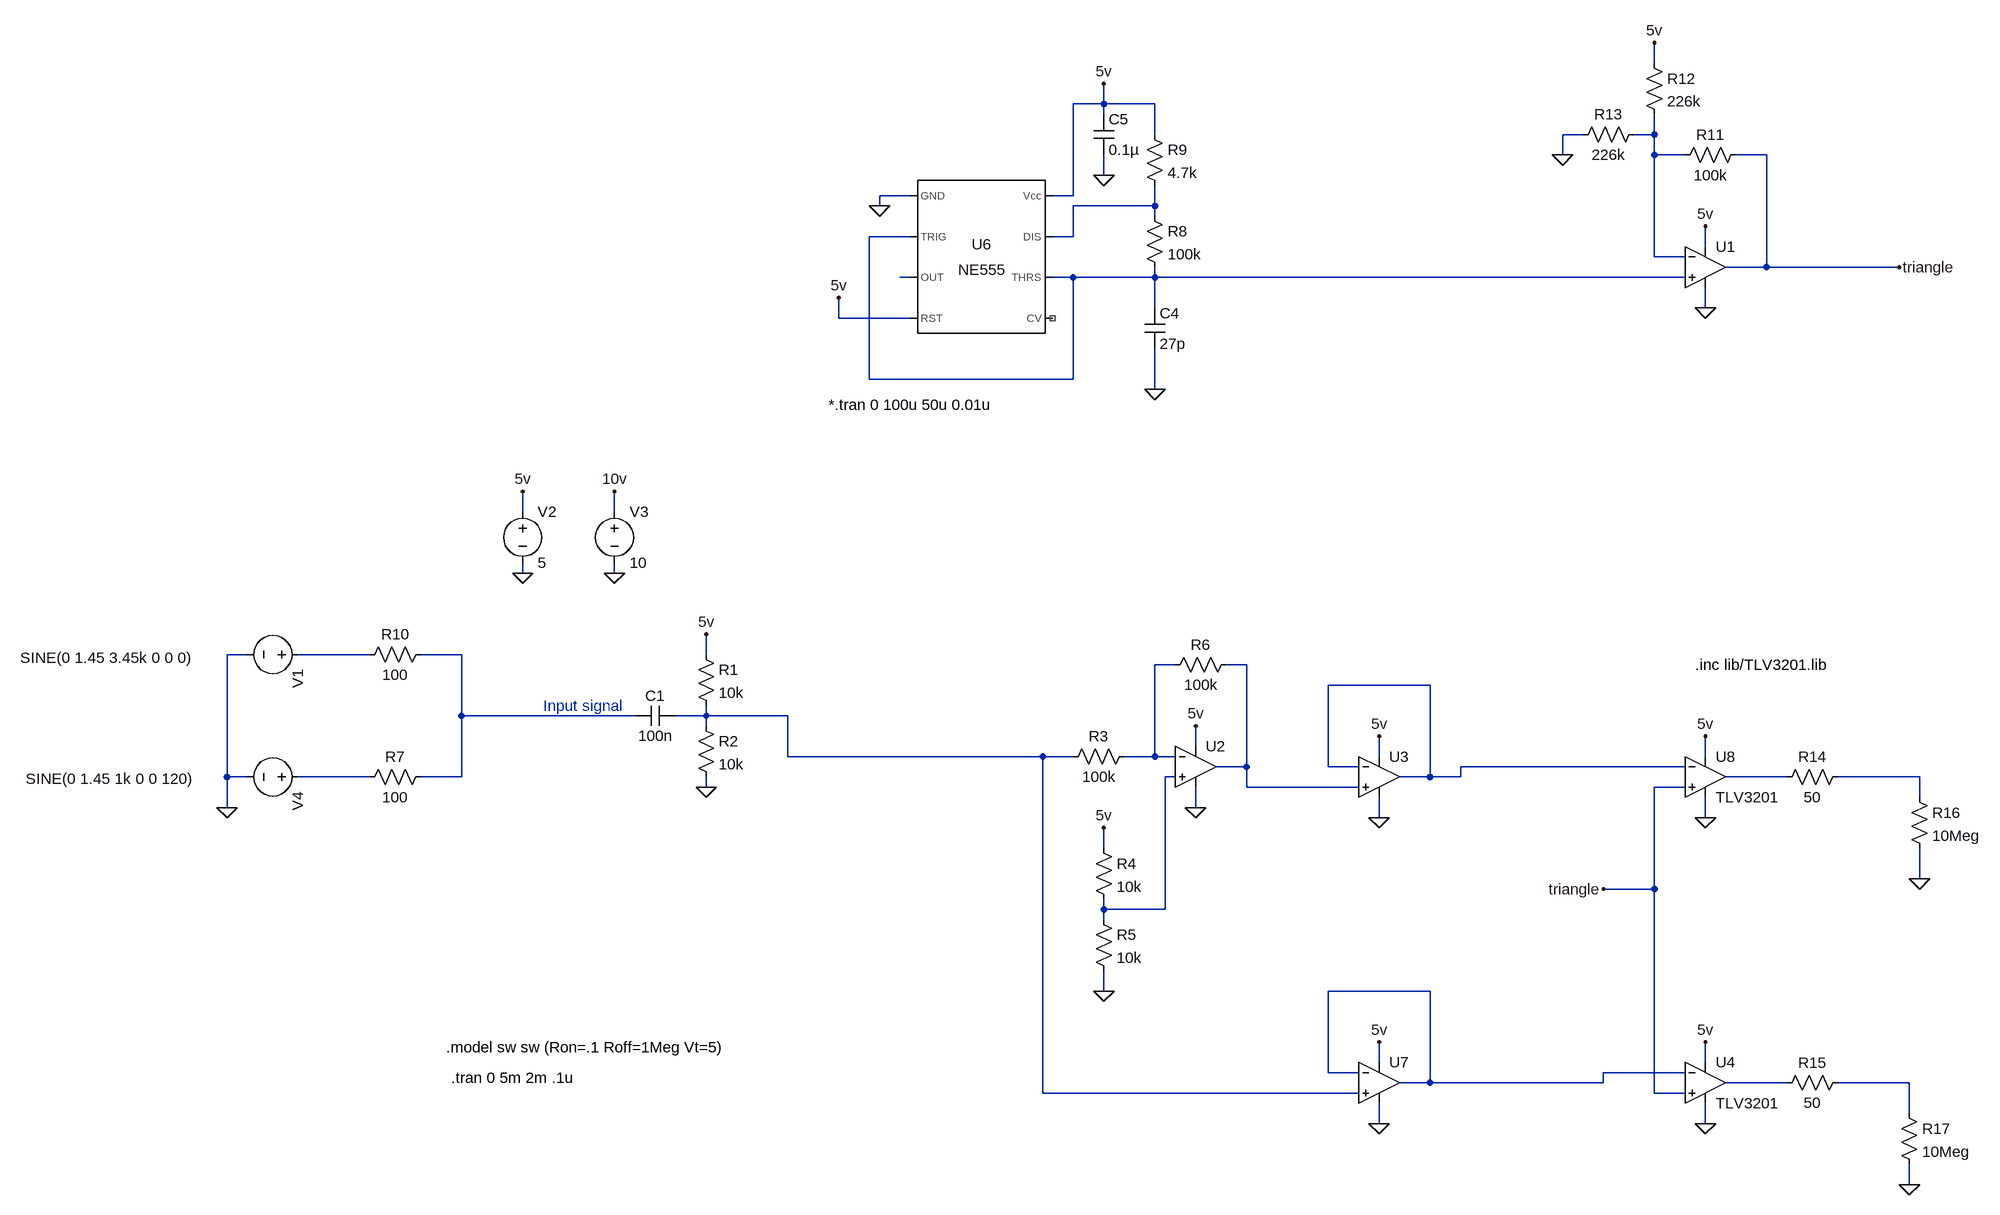
[diagram p0: schematic test.asc]
test.asc, the LTspice schematic file:
Version 4
SHEET 1 4872 804
WIRE 2064 -976 2064 -1008
WIRE 1200 -912 1200 -944
WIRE 1200 -912 1152 -912
WIRE 1280 -912 1200 -912
WIRE 1200 -896 1200 -912
WIRE 1280 -864 1280 -912
WIRE 1952 -864 1920 -864
WIRE 2064 -864 2064 -896
WIRE 2064 -864 2032 -864
WIRE 1920 -832 1920 -864
WIRE 2064 -832 2064 -864
WIRE 2112 -832 2064 -832
WIRE 2240 -832 2192 -832
WIRE 1200 -800 1200 -832
WIRE 896 -768 848 -768
WIRE 1152 -768 1152 -912
WIRE 1152 -768 1120 -768
WIRE 848 -752 848 -768
WIRE 1280 -752 1280 -784
WIRE 1280 -752 1152 -752
WIRE 1280 -736 1280 -752
WIRE 896 -704 832 -704
WIRE 1152 -704 1152 -752
WIRE 1152 -704 1120 -704
WIRE 2144 -688 2144 -720
WIRE 2064 -672 2064 -832
WIRE 2112 -672 2064 -672
WIRE 2240 -656 2240 -832
WIRE 2240 -656 2176 -656
WIRE 2448 -656 2240 -656
WIRE 896 -640 880 -640
WIRE 1152 -640 1120 -640
WIRE 1280 -640 1280 -656
WIRE 1280 -640 1152 -640
WIRE 2112 -640 1280 -640
WIRE 1280 -592 1280 -640
WIRE 2144 -592 2144 -624
WIRE 784 -576 784 -608
WIRE 896 -576 784 -576
WIRE 832 -480 832 -704
WIRE 1152 -480 1152 -640
WIRE 1152 -480 832 -480
WIRE 1280 -464 1280 -528
WIRE 288 -272 288 -304
WIRE 432 -272 432 -304
WIRE 288 -176 288 -192
WIRE 432 -176 432 -192
WIRE -144 -48 -176 -48
WIRE 48 -48 -64 -48
WIRE 192 -48 128 -48
WIRE 576 -48 576 -80
WIRE 1312 -32 1280 -32
WIRE 1424 -32 1392 -32
WIRE 1712 0 1552 0
WIRE 192 48 192 -48
WIRE 464 48 192 48
WIRE 576 48 576 32
WIRE 576 48 528 48
WIRE 704 48 576 48
WIRE 576 64 576 48
WIRE 1344 96 1344 64
WIRE 704 112 704 48
WIRE 1104 112 704 112
WIRE 1152 112 1104 112
WIRE 1280 112 1280 -32
WIRE 1280 112 1232 112
WIRE 1312 112 1280 112
WIRE 1632 112 1632 80
WIRE 2144 112 2144 80
WIRE 1424 128 1424 -32
WIRE 1424 128 1376 128
WIRE 1552 128 1552 0
WIRE 1600 128 1552 128
WIRE 2112 128 1760 128
WIRE -176 144 -176 -48
WIRE -144 144 -176 144
WIRE 48 144 -64 144
WIRE 192 144 192 48
WIRE 192 144 128 144
WIRE 1312 144 1296 144
WIRE 1712 144 1712 0
WIRE 1712 144 1664 144
WIRE 1760 144 1760 128
WIRE 1760 144 1712 144
WIRE 2272 144 2176 144
WIRE 2480 144 2352 144
WIRE 576 160 576 144
WIRE 1424 160 1424 128
WIRE 1600 160 1424 160
WIRE 2112 160 2064 160
WIRE 2480 176 2480 144
WIRE -176 192 -176 144
WIRE 1344 192 1344 160
WIRE 1632 208 1632 176
WIRE 2144 208 2144 176
WIRE 1200 256 1200 224
WIRE 2480 304 2480 256
WIRE 2064 320 2064 160
WIRE 2064 320 1984 320
WIRE 1200 352 1200 336
WIRE 1296 352 1296 144
WIRE 1296 352 1200 352
WIRE 1200 368 1200 352
WIRE 1200 480 1200 448
WIRE 1712 480 1552 480
WIRE 1632 592 1632 560
WIRE 2144 592 2144 560
WIRE 1552 608 1552 480
WIRE 1600 608 1552 608
WIRE 2112 608 1984 608
WIRE 1712 624 1712 480
WIRE 1712 624 1664 624
WIRE 1984 624 1984 608
WIRE 1984 624 1712 624
WIRE 2272 624 2176 624
WIRE 2464 624 2352 624
WIRE 1104 640 1104 112
WIRE 1600 640 1104 640
WIRE 2064 640 2064 320
WIRE 2112 640 2064 640
WIRE 2464 672 2464 624
WIRE 1632 688 1632 656
WIRE 2144 688 2144 656
WIRE 2464 784 2464 752
FLAG 576 160 0
FLAG 576 -80 5v
FLAG 288 -176 0
FLAG 288 -304 5v
FLAG 1344 64 5v
FLAG 1344 192 0
FLAG 1200 480 0
FLAG 1200 224 5v
FLAG 1200 -800 0
FLAG 1200 -944 5v
FLAG 784 -608 5v
FLAG 2448 -656 triangle
FLAG 432 -176 0
FLAG 432 -304 10v
FLAG 1632 208 0
FLAG 1632 688 0
FLAG 1632 80 5v
FLAG 1632 560 5v
FLAG 2144 208 0
FLAG 2144 688 0
FLAG 2144 80 5v
FLAG 2144 560 5v
FLAG 1984 320 triangle
FLAG 848 -752 0
FLAG 1280 -464 0
FLAG 2144 -592 0
FLAG 2144 -720 5v
FLAG 2064 -1008 5v
FLAG 1920 -832 0
FLAG -176 192 0
FLAG 2480 304 0
FLAG 2464 784 0
SYMBOL voltage -48 -48 R90
WINDOW 123 0 0 Left 0
WINDOW 39 0 0 Left 0
WINDOW 3 5 186 VRight 2
SYMATTR Value SINE(0 1.45 3.45k 0 0 0)
SYMATTR InstName V1
SYMBOL cap 528 32 R90
WINDOW 0 0 32 VBottom 2
WINDOW 3 32 32 VTop 2
SYMATTR InstName C1
SYMATTR Value 100n
SYMBOL res 560 -64 R0
SYMATTR InstName R1
SYMATTR Value 10k
SYMATTR SpiceLine tol=1
SYMBOL res 560 48 R0
SYMATTR InstName R2
SYMATTR Value 10k
SYMATTR SpiceLine tol=1
SYMBOL voltage 288 -288 R0
WINDOW 123 0 0 Left 0
WINDOW 39 0 0 Left 0
SYMATTR InstName V2
SYMATTR Value 5
SYMBOL res 1248 96 R90
WINDOW 0 0 56 VBottom 2
WINDOW 3 32 56 VTop 2
SYMATTR InstName R3
SYMATTR Value 100k
SYMATTR SpiceLine tol=1
SYMBOL res 1184 240 R0
SYMATTR InstName R4
SYMATTR Value 10k
SYMATTR SpiceLine tol=1
SYMBOL res 1184 352 R0
SYMATTR InstName R5
SYMATTR Value 10k
SYMATTR SpiceLine tol=1
SYMBOL res 1408 -48 R90
WINDOW 0 0 56 VBottom 2
WINDOW 3 32 56 VTop 2
SYMATTR InstName R6
SYMATTR Value 100k
SYMATTR SpiceLine tol=1
SYMBOL Misc\\NE555 1008 -672 R0
SYMATTR InstName U6
SYMBOL cap 1264 -592 R0
SYMATTR InstName C4
SYMATTR Value 27p
SYMATTR SpiceLine V=50 Irms=0 Rser=0 Lser=0 mfg="Murata" pn="GRM0335C1H270JA01" type="C0G"
SYMBOL res 1264 -752 R0
SYMATTR InstName R8
SYMATTR Value 100k
SYMATTR SpiceLine tol=0.1 pwr=100m
SYMBOL res 1264 -880 R0
SYMATTR InstName R9
SYMATTR Value 4.7k
SYMATTR SpiceLine tol=0.1 pwr=100m
SYMBOL cap 1184 -896 R0
SYMATTR InstName C5
SYMATTR Value 0.1µ
SYMBOL voltage 432 -288 R0
WINDOW 123 0 0 Left 0
WINDOW 39 0 0 Left 0
SYMATTR InstName V3
SYMATTR Value 10
SYMBOL res 2208 -848 R90
WINDOW 0 0 56 VBottom 2
WINDOW 3 32 56 VTop 2
SYMATTR InstName R11
SYMATTR Value 100k
SYMATTR SpiceLine tol=1
SYMBOL res 2048 -992 R0
SYMATTR InstName R12
SYMATTR Value 226k
SYMATTR SpiceLine tol=1
SYMBOL res 2048 -880 R90
WINDOW 0 0 56 VBottom 2
WINDOW 3 32 56 VTop 2
SYMATTR InstName R13
SYMATTR Value 226k
SYMATTR SpiceLine tol=1
SYMBOL OpAmps\\UniversalOpAmp2 2144 -656 R0
SYMATTR InstName U1
SYMATTR Value2 Avol=1Meg GBW=50Meg Slew=38Meg
SYMBOL OpAmps\\UniversalOpAmp2 1344 128 R0
SYMATTR InstName U2
SYMATTR Value2 Avol=1Meg GBW=50Meg Slew=38Meg
SYMBOL OpAmps\\UniversalOpAmp2 1632 144 R0
SYMATTR InstName U3
SYMATTR Value2 Avol=1Meg GBW=50Meg Slew=38Meg
SYMBOL OpAmps\\UniversalOpAmp2 1632 624 R0
SYMATTR InstName U7
SYMATTR Value2 Avol=1Meg GBW=50Meg Slew=38Meg
SYMBOL OpAmps\\opamp2 2144 80 R0
SYMATTR InstName U8
SYMATTR Value TLV3201
SYMBOL OpAmps\\opamp2 2144 560 R0
SYMATTR InstName U4
SYMATTR Value TLV3201
SYMBOL voltage -48 144 R90
WINDOW 123 0 0 Left 0
WINDOW 39 0 0 Left 0
WINDOW 3 3 184 VRight 2
SYMATTR Value SINE(0 1.45 1k 0 0 120)
SYMATTR InstName V4
SYMBOL res 144 128 R90
WINDOW 0 0 56 VBottom 2
WINDOW 3 32 56 VTop 2
SYMATTR InstName R7
SYMATTR Value 100
SYMATTR SpiceLine tol=1
SYMBOL res 144 -64 R90
WINDOW 0 0 56 VBottom 2
WINDOW 3 32 56 VTop 2
SYMATTR InstName R10
SYMATTR Value 100
SYMATTR SpiceLine tol=1
SYMBOL res 2368 128 R90
WINDOW 0 0 56 VBottom 2
WINDOW 3 32 56 VTop 2
SYMATTR InstName R14
SYMATTR Value 50
SYMBOL res 2368 608 R90
WINDOW 0 0 56 VBottom 2
WINDOW 3 32 56 VTop 2
SYMATTR InstName R15
SYMATTR Value 50
SYMBOL res 2464 160 R0
SYMATTR InstName R16
SYMATTR Value 10Meg
SYMBOL res 2448 656 R0
SYMATTR InstName R17
SYMATTR Value 10Meg
TEXT 320 32 Left 2 ;Input signal
TEXT 176 616 Left 2 !.tran 0 5m 2m .1u
TEXT 168 568 Left 2 !.model sw sw (Ron=.1 Roff=1Meg Vt=5)
TEXT 768 -440 Left 2 !*.tran 0 100u 50u 0.01u
TEXT 2128 -32 Left 2 !.inc lib/TLV3201.lib

The netlist it stands for:
* test.asc
V1 N005 0 SINE(0 1.45 3.45k 0 0 0)
C1 N010 N006 100n
R1 5v N010 10k tol=1
R2 N010 0 10k tol=1
V2 5v 0 5
R3 N007 N010 100k tol=1
R4 5v N012 10k tol=1
R5 N012 0 10k tol=1
R6 N008 N007 100k tol=1
XU6 0 N003 N004 5v NC_01 N003 N002 5v NE555  ; pins GND TRIG OUT RST CV THRS DIS Vcc
C4 N003 0 27p V=50 Irms=0 Rser=0 Lser=0 mfg="Murata" pn="GRM0335C1H270JA01" type="C0G"
R8 N002 N003 100k tol=0.1 pwr=100m
R9 5v N002 4.7k tol=0.1 pwr=100m
C5 5v 0 0.1µ
V3 10v 0 10
R11 triangle N001 100k tol=1
R12 5v N001 226k tol=1
R13 N001 0 226k tol=1
XU1 N003 N001 5v 0 triangle level2 Avol=1Meg GBW=50Meg Slew=38Meg Ilimit=25m Rail=0 Vos=0 En=0 Enk=0 In=0 Ink=0 Rin=500Meg  ; pins In+ In- V+ V- OUT
XU2 N012 N007 5v 0 N008 level2 Avol=1Meg GBW=50Meg Slew=38Meg Ilimit=25m Rail=0 Vos=0 En=0 Enk=0 In=0 Ink=0 Rin=500Meg  ; pins In+ In- V+ V- OUT
XU3 N008 N009 5v 0 N009 level2 Avol=1Meg GBW=50Meg Slew=38Meg Ilimit=25m Rail=0 Vos=0 En=0 Enk=0 In=0 Ink=0 Rin=500Meg  ; pins In+ In- V+ V- OUT
XU7 N010 N015 5v 0 N015 level2 Avol=1Meg GBW=50Meg Slew=38Meg Ilimit=25m Rail=0 Vos=0 En=0 Enk=0 In=0 Ink=0 Rin=500Meg  ; pins In+ In- V+ V- OUT
XU8 triangle N009 5v 0 N013 TLV3201  ; pins In+ In- V+ V- OUT
XU4 triangle N015 5v 0 N016 TLV3201  ; pins In+ In- V+ V- OUT
V4 N011 0 SINE(0 1.45 1k 0 0 120)
R7 N006 N011 100 tol=1
R10 N006 N005 100 tol=1
R14 N014 N013 50
R15 N017 N016 50
R16 N014 0 10Meg
R17 N017 0 10Meg
* Input signal
.tran 0 5m 2m .1u
.model sw sw (Ron=.1 Roff=1Meg Vt=5)
*.tran 0 100u 50u 0.01u
.inc lib/TLV3201.lib
.lib NE555.sub
.lib UniversalOpAmp2.lib
.backanno
.end